# Altium schematic sheet Crystal.schdoc
size 54 x 35 mm
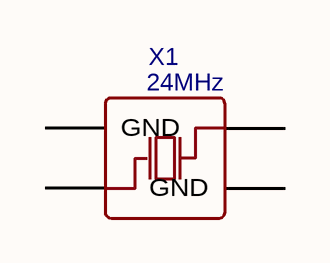
[diagram p0: Crystal.schdoc]

## Parts
X1  24MHz  [CRYSTAL-SMD_4P-L3.2-W2.5-BL]

## Nets

Not connected (* = marked no-connect by the designer): X1 1(OSC1) 2(GND) 3(OSC2) 4(GND)

## Library data of the parts
X1 = 24MHz: BOM_Manufacturer: EPSON; BOM_Manufacturer Part: X1E0000210264000G; nameAlias: Frequency; Contributor: LCSC; BOM_Paste Type: Extended Part; BOM_Supplier: LCSC; BOM_Supplier Part: C91744; BOM_JLCPCB Part Class: Extended Part; spicePre: X; spiceSymbolName: X1E0000210264000G